# Altium schematic sheet GDRIVE3.SchDoc
size A3
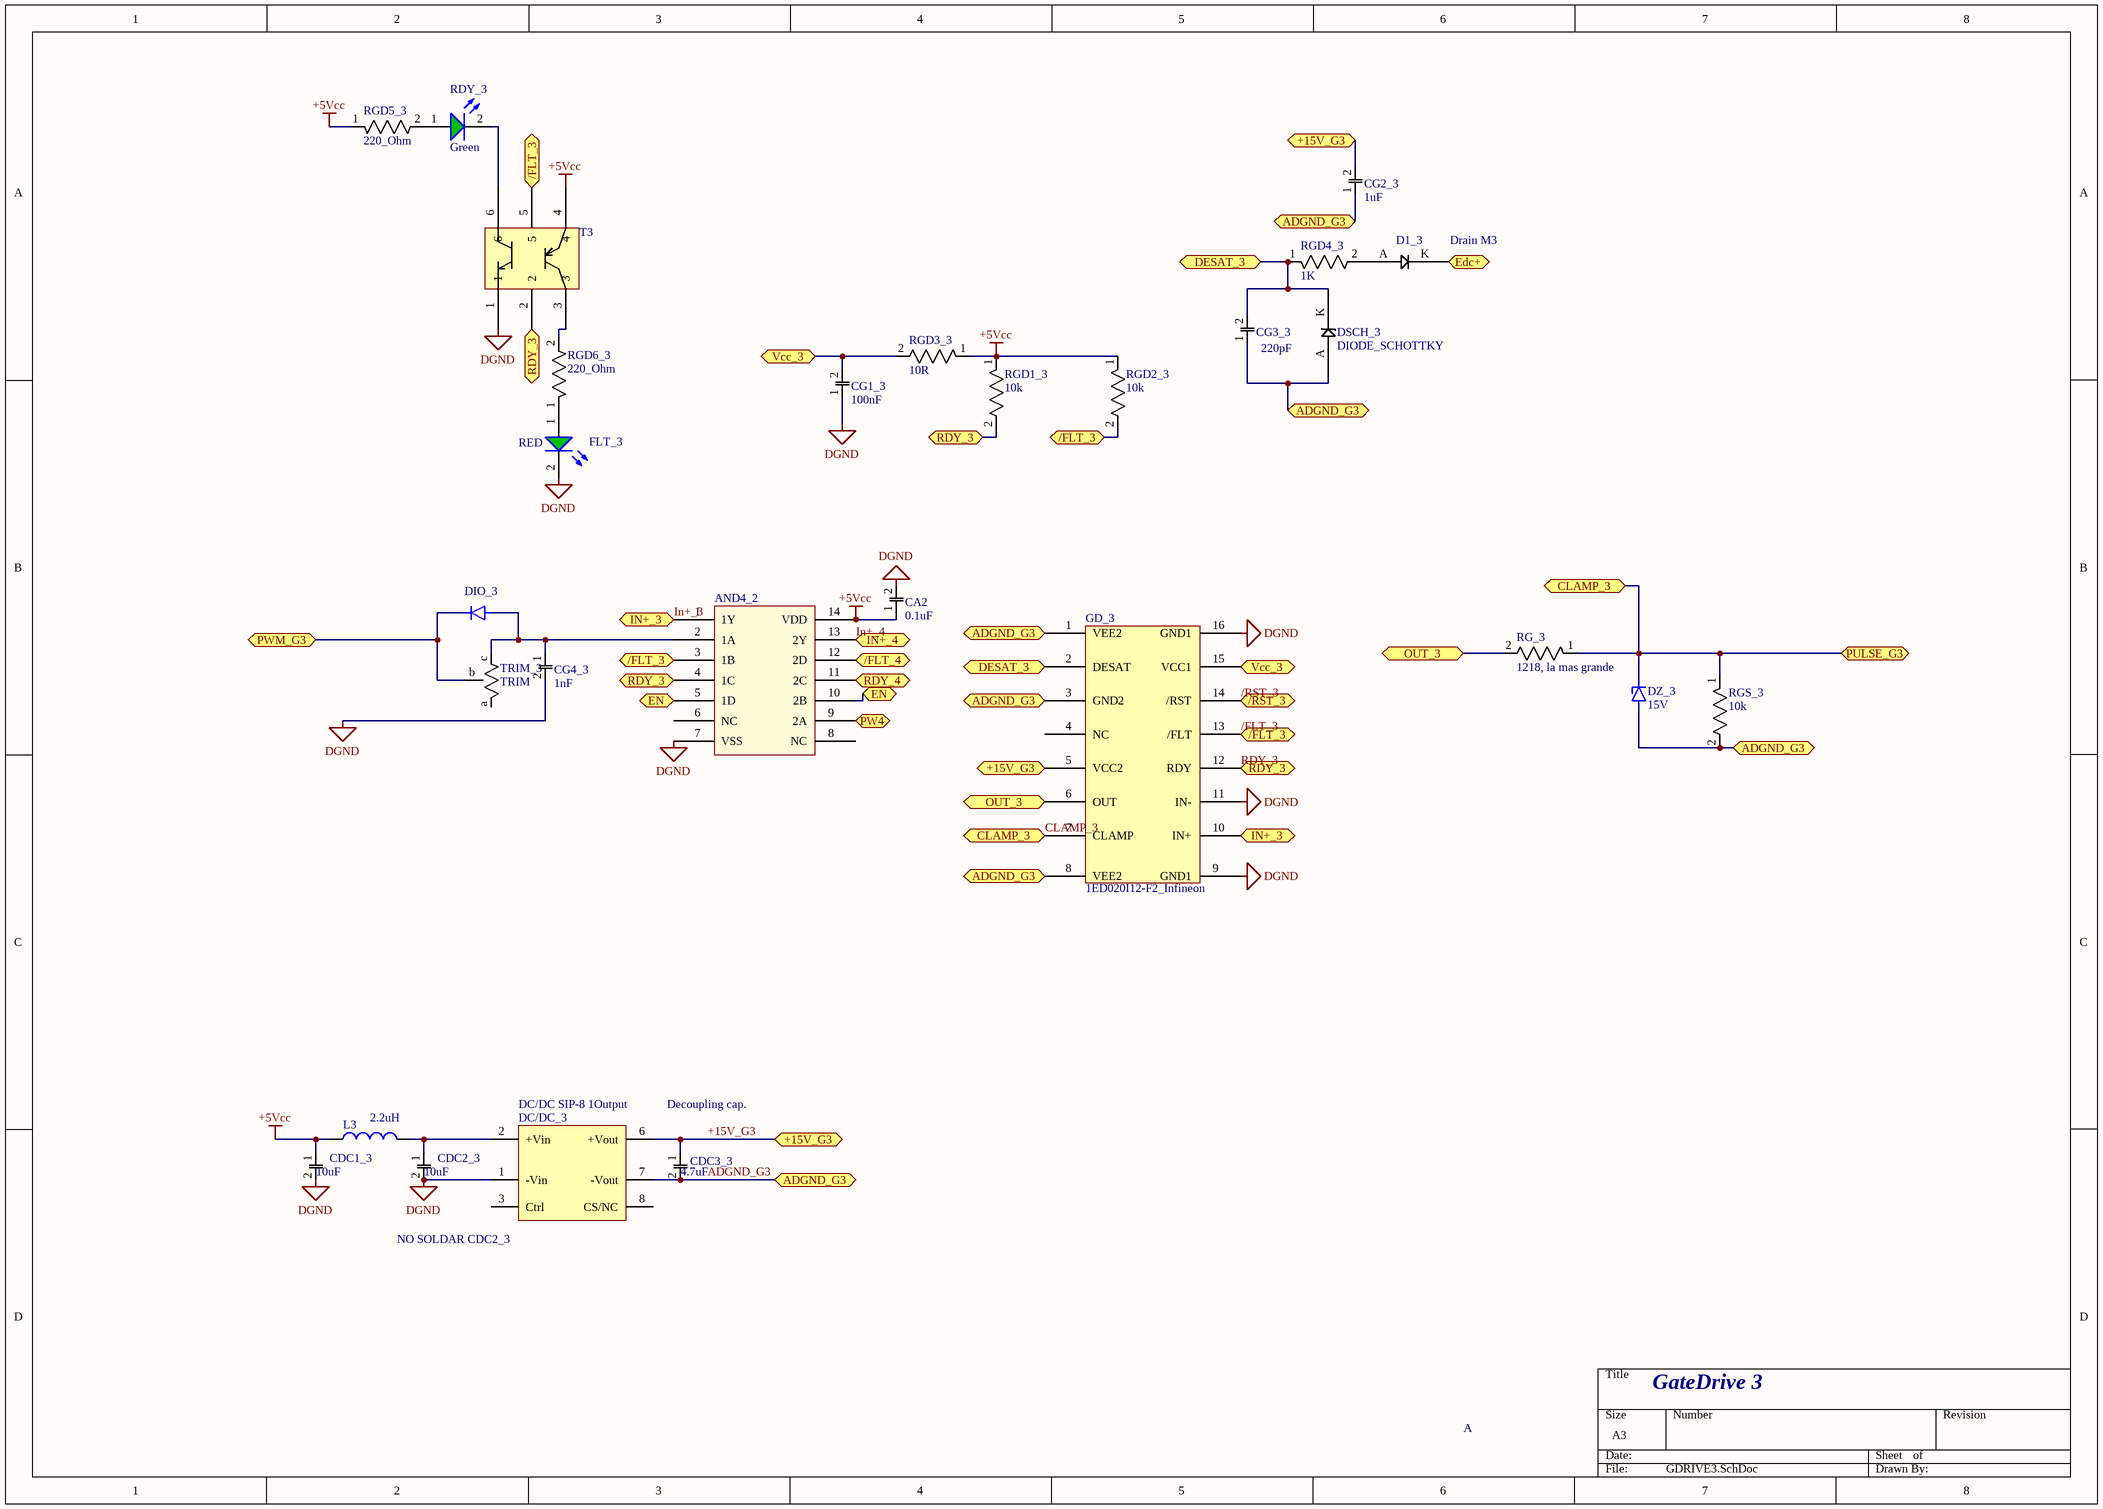
[diagram p0: GDRIVE3.SchDoc]

## Parts
AND4_2  AND_4_2  [SOIC-14]  (value not drawn)
CA2  0.1uF  [CAP_0603]
CDC1_3  10uF  [C1206]
CDC2_3  10uF  [C1206]
CDC3_3  4.7uF  [C1206]
CG1_3  100nF  [CAP_0805_L]
CG2_3  1uF  [CAP_0603]
CG3_3  220pF  [CAP_0603]
CG4_3  1nF  [CAP_0805]
D1_3  DIODE  [DO-214AC]  (value not drawn)
DC/DC_3  DC/DC SIP-8 1Output  [DC/DC SIP-8]
DIO_3  DIOde  [DIO_BAS85-GS08]  (value not drawn)
DSCH_3  DIODE_SCHOTTKY  [SOD323W]
DZ_3  15V  [BZV55-C15,115]
FLT_3  RED  [LED_0805]
GD_3  1ED020I12-F2_Infineon  [SOIC_16W]
L3  2.2uH  [RES_0805]
RDY_3  Green  [LED_0805]
RG_3  1218, la mas grande  [RES_1218]
RGD1_3  10k  [0603]
RGD2_3  10k  [0603]
RGD3_3  10R  [RES_1206]
RGD4_3  1K  [RES_0805]
RGD5_3  220_Ohm  [res_0805]
RGD6_3  220_Ohm  [res_0805]
RGS_3  10k  [RES_1206]
T3  TRANS PREBIAS  [SOT363_]  (value not drawn)
TRIM_3  TRIM  [TRIM_TS53YJ203MR10]

## Ports
+15V_G3 (bidir), /FLT_3 (bidir), /FLT_4 (bidir), /RST_3 (bidir), ADGND_G3 (bidir), CLAMP_3 (bidir), DESAT_3 (bidir), Edc+ (bidir), EN (bidir), IN+_3 (bidir), IN+_4 (bidir), OUT_3 (bidir), PULSE_G3 (bidir), PW4 (bidir), PWM_G3 (bidir), RDY_3 (bidir), RDY_4 (bidir), Vcc_3 (bidir)

## Nets
+5Vcc: AND4_2.14(VDD) CA2.1 CDC1_3.1 L3.1 RGD1_3.1(C) RGD2_3.1(C) RGD3_3.1(C) RGD5_3.1(C) T3.4
DGND: AND4_2.7(VSS) CA2.2 CDC1_3.2 CDC2_3.2 CG1_3.1 CG4_3.2 DC/DC_3.1(-Vin) FLT_3.2(C) GD_3.9(GND1) GD_3.11(IN-) GD_3.16(GND1) T3.1
+15V_G3: CDC3_3.1 CG2_3.2 DC/DC_3.6(+Vout) GD_3.5(VCC2) ; port +15V_G3
/FLT_3: AND4_2.3(1B) GD_3.13(/FLT) RGD2_3.2(A) T3.5 ; port /FLT_3
/FLT_4: AND4_2.12(2D) ; port /FLT_4
/RST_3: GD_3.14(/RST) ; port /RST_3
ADGND_G3: CDC3_3.2 CG2_3.1 CG3_3.1 DC/DC_3.7(-Vout) DSCH_3.A DZ_3.2(Anodo) GD_3.1(VEE2) GD_3.3(GND2) GD_3.8(VEE2) RGS_3.2(A) ; port ADGND_G3
CLAMP_3: DZ_3.1(Catodo) GD_3.7(CLAMP) RG_3.1(C) RGS_3.1(C) ; port CLAMP_3, port PULSE_G3
DESAT_3: CG3_3.2 DSCH_3.K GD_3.2(DESAT) RGD4_3.1(C) ; port DESAT_3
Edc+: D1_3.K ; port Edc+
EN: AND4_2.5(1D) AND4_2.10(2B) ; port EN
In+_3: AND4_2.1(1Y) GD_3.10(IN+) ; port IN+_3
In+_4: AND4_2.13(2Y) ; port IN+_4
OUT_3: GD_3.6(OUT) RG_3.2(A) ; port OUT_3
PW4: AND4_2.9(2A) ; port PW4
PWM_G3: DIO_3.1(Catodo) TRIM_3.b ; port PWM_G3
RDY_3: AND4_2.4(1C) GD_3.12(RDY) RGD1_3.2(A) T3.2 ; port RDY_3
RDY_4: AND4_2.11(2C) ; port RDY_4
Vcc_3: CG1_3.2 GD_3.15(VCC1) RGD3_3.2(A) ; port Vcc_3
NetAND4_2_2: AND4_2.2(1A) CG4_3.1 DIO_3.2(Anodo) TRIM_3.c
NetCDC2_3_1: CDC2_3.1 DC/DC_3.2(+Vin) L3.2
NetD1_3_A: D1_3.A RGD4_3.2(A)
NetFLT_3_1: FLT_3.1(A) RGD6_3.1(C)
NetRDY_3_1: RDY_3.1(A) RGD5_3.2(A)
NetRDY_3_2: RDY_3.2(C) T3.6
NetRGD6_3_2: RGD6_3.2(A) T3.3

Not connected (* = marked no-connect by the designer): AND4_2 6(NC) 8(NC); DC/DC_3 3(Ctrl) 8(CS/NC); GD_3 4(NC); TRIM_3 a

## Notes on the sheet
- (near D1_3) Drain M3
- Decoupling cap.
- (near DC/DC_3) NO SOLDAR CDC2_3
- GateDrive 3
- A

## Library data of the parts
AND4_2 = AND_4_2: IC GATE AND 2CH 4-INP 14-SO; Manufacturer Part Number: HEF4082BT,653; Digi-Key Part Number: 1727-6011-1-ND; RS Part Number: *
CA2 = CAP_0603YC104KAT2A: 0.1µF ±10% 16V Ceramic Capacitor X7R 0603 (1608 Metric); Digi-Key Part Number: 478-1239-1-ND; Manufacturer Part Number: 0603YC104KAT2A; RS Part Number: *
CDC1_3 CDC2_3 = CAP_C0805C105Z3VACTU: CAP CER 10UF 35V X6S 1206; Manufacturer Part Number: C3216X6S1V106K160AC; Digi-Key Part Number: 445-14778-1-ND; RS Part Number: 723-6647
CDC3_3 = CAP_C0805C105Z3VACTU: CAP CER 4.7UF 35V X7R 1206; Manufacturer Part Number: C3216X7R1V475K085AC; Digi-Key Part Number: 445-14805-1-ND; RS Part Number: *
CG1_3 = CAP_0603YC104KAT2A: CAP CER 0.1UF 50V X7R 0805; Manufacturer Part Number: 08055C104KAT2A; Digi-Key Part Number: 478-1395-1-ND; RS Part Number: *
CG2_3 = CAP_0603YC104KAT2A: CAP CER 1UF 50V X5R 0603; Manufacturer Part Number: CGA3E3X5R1H105K080AB; Digi-Key Part Number: 445-7878-1-ND; RS Part Number: *
CG3_3 = CAP_0603YC104KAT2A: CAP CER 220PF 50V C0G/NP0 0603; Manufacturer Part Number: C0603C221F5GACTU; Digi-Key Part Number: 399-7876-1-ND; RS Part Number: *
CG4_3 = CAP_C0805C102J5GACTU: CAP CER 1000PF 50V C0G/NP0 0805; Digi-Key Part Number: 399-1136-1-ND; Manufacturer Part Number: C0805C102J5GACTU; RS Part Number: *
D1_3 = DIODE: DIODE GEN PURP 1KV 1A SMA; Manufacturer Part Number: RS1MTR; Digi-Key Part Number: 1655-1501-1-ND; RS Part Number: *
DIO_3 = DIO_BAS85-GS08: DIODE SCHOTTKY 30V 200MA SOD80; Digi-Key Part Number: BAS85-GS08CT-ND; Manufacturer Part Number: BAS85-GS08; RS Part Number: *
DSCH_3 = DIODE_SCHOTTKY: DIODE SCHOTTKY 40V 750MA SOD323; Manufacturer Part Number: BAT165E6327HTSA1; Digi-Key Part Number: BAT165E6327HTSA1CT-ND; RS Part Number: *
DZ_3 = DIO_BZV55-C15,115: DIODE ZENER 15V 500MW SOD80C; Digi-Key Part Number: 1727-4962-1-ND; Manufacturer Part Number: BZV55-C15,115; RS Part Number: 484-3227
FLT_3 = WL-SMCW 0805  150080GS75000: LED RED CLEAR 0805 SMD; Manufacturer Part Number: 150080RS75000; Digi-Key Part Number: 732-4984-1-ND; RS Part Number: 815-4225
GD_3 = 1ED020I12-F2_Infineon: IC IGBT DVR 1200V 2A DSO16; Manufacturer Part Number: 1ED020I12F2XUMA1; Digi-Key Part Number: 1ED020I12F2XUMA1CT-ND; RS Part Number: 110-9111
L3 = Inductor: FIXED IND 2.2UH 600MA 160 MOHM; Manufacturer Part Number: MLZ2012M2R2HT000; Digi-key Part Number: 445-8658-1-ND; RS Part Number: *
RDY_3 = WL-SMCW 0805  150080GS75000: LED RED CLEAR 0805 SMD; Manufacturer Part Number: 150080VS75000; Digi-Key Part Number: 732-4986-1-ND
RG_3 = RES_RCL121847R0JNEK: RON 1218; Manufacturer Part Number: *; Digi-Key Part Number: *; RS Part Number: *
RGD1_3 RGD2_3 = RES_RCL121847R0JNEK: RES SMD 10K OHM 0.1% 3/8W 0603; Manufacturer Part Number: PHP00603E1002BST1; Digi-Key Part Number: 764-1103-6-ND; RS Part Number: 818-3052
RGD3_3 = RES_RCL121847R0JNEK: RES SMD 10 OHM 1W 1206 WIDE; Manufacturer Part Number: PRG3216P-10R0-D-T5; Digi-Key Part Number: 408-1809-1-ND; RS Part Number: *
RGD4_3 = RES_RCL121847R0JNEK: RES SMD 1K OHM 0.1% 1W 0805; Manufacturer Part Number: PCAN0805E1001BST5; Digi-Key Part Number: 764-1240-6-ND; RS Part Number: *
RGD5_3 RGD6_3 = RES_ERJ-3GEYJ471V: 1% 1/4W 0805; Manufacturer Part Number: RC0603FR-07220RL; Digi-Key Part Number: 311-220HRCT-ND; RS Part Number: *
RGS_3 = RES_ERJ-8ENF2002V: RES SMD 10K OHM 0-1% 1W 1206; Manufacturer Part Number: PHP01206E1002BST5; Digi-Key Part Number: PHP10.0KADKR_ND; RS Part Number: *
T3 = TRANS PREBIAS: TRANS PREBIAS NPN/PNP SOT666; Manufacturer Part Number: PUMD16,115; Digi-Key Part Number: 1727-3930-1-ND; RS Part Number: 518-3734
TRIM_3 = TRIM_TS53YJ203MR10: TRIMMER 1K OHM 0.25W SMD; Manufacturer Part Number: TS53YJ102MR10; Digi-Key Part Number: TS53YJ-1.0KCT-ND